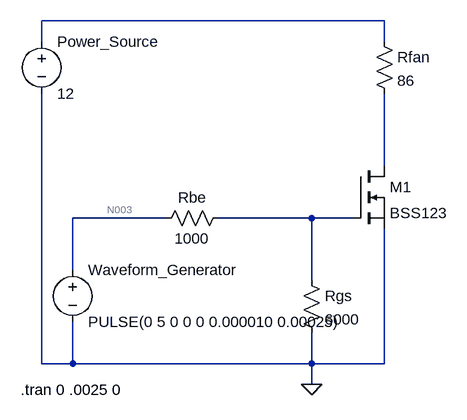
[diagram p0: schematic N-MOSFET_FAN.asc]
N-MOSFET_FAN.asc, the LTspice schematic file:
Version 4
SHEET 1 880 680
WIRE 224 -352 -304 -352
WIRE -304 -320 -304 -352
WIRE 224 -320 224 -352
WIRE 224 -128 224 -240
WIRE -112 -48 -256 -48
WIRE 112 -48 -32 -48
WIRE 176 -48 112 -48
WIRE -256 32 -256 -48
WIRE 112 48 112 -48
WIRE -304 176 -304 -240
WIRE -256 176 -256 112
WIRE -256 176 -304 176
WIRE 112 176 112 128
WIRE 112 176 -256 176
WIRE 224 176 224 -32
WIRE 224 176 112 176
WIRE 112 208 112 176
FLAG 112 208 0
SYMBOL res 208 -336 R0
SYMATTR InstName Rfan
SYMATTR Value 86
SYMBOL res 96 32 R0
SYMATTR InstName Rgs
SYMATTR Value 6000
SYMBOL res -16 -64 R90
WINDOW 0 0 56 VBottom 2
WINDOW 3 32 56 VTop 2
SYMATTR InstName Rbe
SYMATTR Value 1000
SYMBOL nmos 176 -128 R0
SYMATTR InstName M1
SYMATTR Value BSS123
SYMBOL voltage -304 -336 R0
WINDOW 123 0 0 Left 0
WINDOW 39 0 0 Left 0
SYMATTR InstName Power_Source
SYMATTR Value 12
SYMBOL voltage -256 16 R0
WINDOW 123 0 0 Left 0
WINDOW 39 0 0 Left 0
SYMATTR InstName Waveform_Generator
SYMATTR Value PULSE(0 5 0 0 0 0.000010 0.00025)
TEXT -336 216 Left 2 !.tran 0 .0025 0

The netlist it stands for:
* N-MOSFET_FAN.asc
Rfan N001 N002 86
Rgs N004 0 6000
Rbe N004 N003 1000
M1 N002 N004 0 0 BSS123
V§Power_Source N001 0 12
V§Waveform_Generator N003 0 PULSE(0 5 0 0 0 0.000010 0.00025)
.model NMOS NMOS
.model PMOS PMOS
.lib standard.mos
.tran 0 .0025 0
.backanno
.end

* Results of the author's LTspice run, read from the files saved beside the schematic
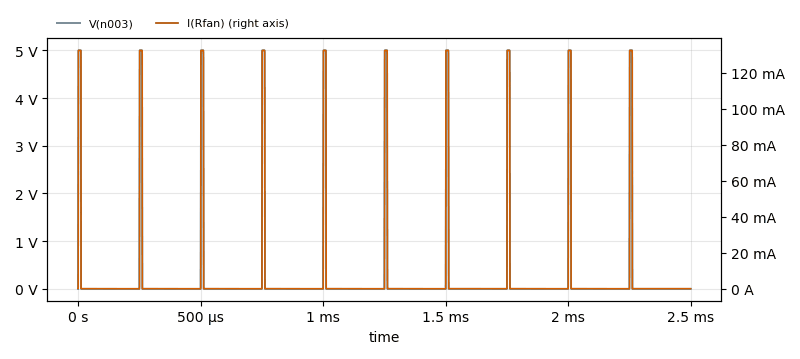
[diagram p1: Transient Analysis of N-MOSFET_FAN.asc, plotted from the saved traces]
* Transient Analysis, 1 run:
*   V(n003): min 0 V, max 5 V, average 220 mV, rms 1.033 V, last 0 V
*   I(Rfan): min -65.08 µA, max 132.4 mA, average 5.915 mA, rms 27.84 mA, last 0 A